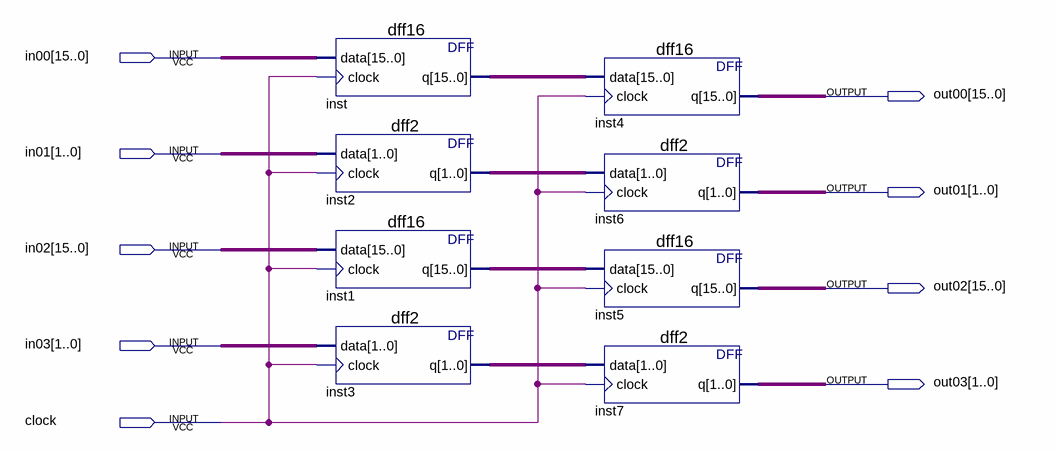
[diagram p0: schematic sheet]
// Quartus schematic Register_Set1.bdf as structural Verilog: 8 symbols, 9 pins
module Register_Set1 (
  input  [15:0] in00,
  input  [1:0] in01,
  input  [15:0] in02,
  input  [1:0] in03,
  input  clock,
  output [15:0] out00,
  output [1:0] out01,
  output [15:0] out02,
  output [1:0] out03
);

  wire [1:0] inst2_q, inst3_q;
  wire [15:0] inst1_q, inst_q;

  dff16 inst (.data(in00), .clock(clock), .q(inst_q));
  dff2 inst2 (.data(in01), .clock(clock), .q(inst2_q));
  dff16 inst1 (.data(in02), .clock(clock), .q(inst1_q));
  dff2 inst3 (.data(in03), .clock(clock), .q(inst3_q));
  dff16 inst4 (.data(inst_q), .clock(clock), .q(out00));
  dff2 inst6 (.data(inst2_q), .clock(clock), .q(out01));
  dff16 inst5 (.data(inst1_q), .clock(clock), .q(out02));
  dff2 inst7 (.data(inst3_q), .clock(clock), .q(out03));
endmodule
